# EAGLE design main (EAGLE 9.5.1)
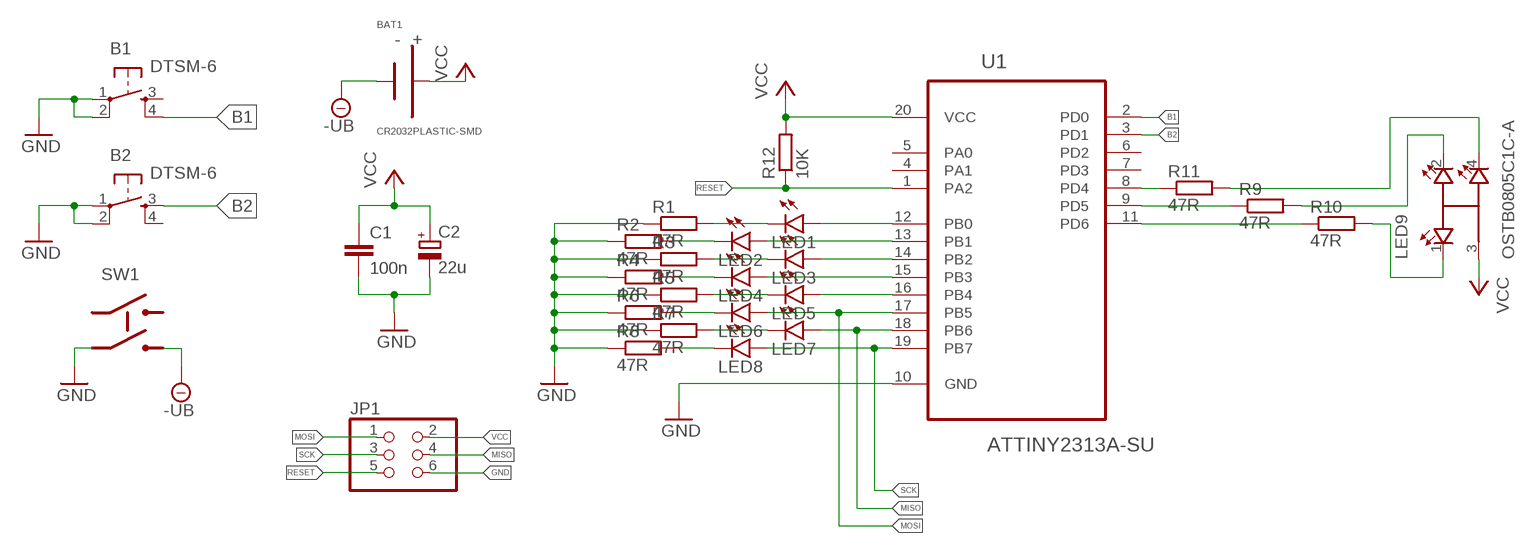
[diagram p0: schematic, sheet 1]

## Parts
B1  DTSM-6  [DTSM-6]
B2  DTSM-6  [DTSM-6]
BAT1  CR2032PLASTIC-SMD  [BIG-SMD]
C1  100n  C-EUC0805  [C0805]
C2  22u  CPOL-EUSMCA  [SMC_A]
JP1  PINHD-2X3  [2X03]
LED1  LEDCHIP-LED0805  [CHIP-LED0805]
LED2  LEDCHIP-LED0805  [CHIP-LED0805]
LED3  LEDCHIP-LED0805  [CHIP-LED0805]
LED4  LEDCHIP-LED0805  [CHIP-LED0805]
LED5  LEDCHIP-LED0805  [CHIP-LED0805]
LED6  LEDCHIP-LED0805  [CHIP-LED0805]
LED7  LEDCHIP-LED0805  [CHIP-LED0805]
LED8  LEDCHIP-LED0805  [CHIP-LED0805]
LED9  OSTB0805C1C-A  [LEDSC200X125X110-4N]
R1  47R  R-EU_R0805  [R0805]
R2  47R  R-EU_R0805  [R0805]
R3  47R  R-EU_R0805  [R0805]
R4  47R  R-EU_R0805  [R0805]
R5  47R  R-EU_R0805  [R0805]
R6  47R  R-EU_R0805  [R0805]
R7  47R  R-EU_R0805  [R0805]
R8  47R  R-EU_R0805  [R0805]
R9  47R  R-EU_R0805  [R0805]
R10  47R  R-EU_R0805  [R0805]
R11  47R  R-EU_R0805  [R0805]
R12  10K  R-EU_R0805  [R0805]
SW1  MSS-22D18  [22D18]
U1  ATTINY2313A-SU  [SOIC127P1032X265-20N]

## Nets
-UB: BAT1.1(MIN) SW1.6(OUT2)
B1: B1.4 U1.2(PD0)
B2: B2.3 U1.3(PD1)
GND: B1.1 B1.2 B2.1 B2.2 C1.2 C2.- JP1.6 R1.1 R2.1 R3.1 R4.1 R5.1 R6.1 R7.1 R8.1 SW1.5(IN2) U1.10(GND)
MISO: JP1.4 LED7.A U1.18(PB6)
MOSI: JP1.1 LED6.A U1.17(PB5)
N$1: LED1.A U1.12(PB0)
N$2: LED1.C R1.2
N$3: LED2.A U1.13(PB1)
N$4: LED2.C R2.2
N$5: LED3.A U1.14(PB2)
N$6: LED3.C R3.2
N$7: LED4.A U1.15(PB3)
N$8: LED4.C R4.2
N$9: LED5.A U1.16(PB4)
N$10: LED5.C R5.2
N$12: LED6.C R6.2
N$14: LED7.C R7.2
N$16: LED8.C R8.2
N$17: R11.1 U1.8(PD4)
N$18: R9.1 U1.9(PD5)
N$19: R10.1 U1.11(PD6)
N$20: LED9.1 R10.2
N$21: LED9.2 R9.2
N$22: LED9.4 R11.2
RESET: JP1.5 R12.1 U1.1(PA2)
SCK: JP1.3 LED8.A U1.19(PB7)
VCC: BAT1.2(PLUS) C1.1 C2.+ JP1.2 LED9.3 R12.2 U1.20(VCC)
Unconnected: B1.3 B2.4 SW1.2(IN1) SW1.3(OUT1) U1.4(PA1) U1.5(PA0) U1.6(PD2) U1.7(PD3)

## Library data of the parts
B1 B2 = switch-tact:DTSM-6
BAT1 = 1Boy-elems:CR2032
C1 = rcl:C-EU: CAPACITOR, European symbol; SPICEPREFIX: C
C2 = resistor:CPOL-EU: POLARIZED CAPACITOR, European symbol
JP1 = pinhead:PINHD-2X3: PIN HEADER
LED1-LED8 = led:LED: LED OSRAM: - CHIPLED LG R971, LG N971, LY N971, LG Q971, LY Q971, LO R971, LY R971 LH N974, LH R974 LS Q976, LO Q976, LY Q976 LO Q996 - Hyper CHIPLED LW Q18S LB Q993, LB Q99A, LB R99A - SideLED LS A670, LO A670, LY A670, LG A670, LP A670 LB A673, LV A673, LT A673, LW A673 LH A674 LY A675 LS A676, LA A676, LO A676, LY A676, LW A676 LS A679, LY A679, LG A679 - Hyper Micro SIDELED® LS Y876, LA Y876, LO Y876, LY Y876 LT Y87S - SmartLED LW L88C, LW L88S LB L89C, LB L89S, LG L890 LS L89K, LO L89K, LY L89K LS L896, LA L896, LO L896, LY L896 - TOPLED LS T670, LO T670, LY T670, LG T670, LP T670 LSG T670, LSP T670, LSY T670, LOP T670, LYG T670 LG T671, LOG T671, LSG T671 LB T673, LV T673, LT T673, LW T673 LH T674 LS T676, LA T676, LO T676, LY T676, LB T676, LH T676, LSB T676, LW T676 LB T67C, LV T67C, LT T67C, LS T67K, LO T67K, LY T67K, LW E67C LS E67B, LA E67B, LO E67B, LY E67B, LB E67C, LV E67C, LT E67C LW T67C LS T679, LY T679, LG T679 LS T770, LO T770, LY T770, LG T770, LP T770 LB T773, LV T773, LT T773, LW T773 LH T774 LS E675, LA E675, LY E675, LS T675 LS T776, LA T776, LO T776, LY T776, LB T776 LHGB T686 LT T68C, LB T68C - Hyper Mini TOPLED® LB M676 - Mini TOPLED Santana® LG M470 LS M47K, LO M47K, LY M47K Source: http://www.osram.convergy.de LUXEON: - LUMILED® LXK2-PW12-R00, LXK2-PW12-S00, LXK2-PW14-U00, LXK2-PW14-V00 LXK2-PM12-R00, LXK2-PM12-S00, LXK2-PM14-U00 LXK2-PE12-Q00, LXK2-PE12-R00, LXK2-PE12-S00, LXK2-PE14-T00, LXK2-PE14-U00 LXK2-PB12-K00, LXK2-PB12-L00, LXK2-PB12-M00, LXK2-PB14-N00, LXK2-PB14-P00, LXK2-PB14-Q00 LXK2-PR12-L00, LXK2-PR12-M00, LXK2-PR14-Q00, LXK2-PR14-R00 LXK2-PD12-Q00, LXK2-PD12-R00, LXK2-PD12-S00 LXK2-PH12-R00, LXK2-PH12-S00 LXK2-PL12-P00, LXK2-PL12-Q00, LXK2-PL12-R00 Source: www.luxeon.com KINGBRIGHT: KA-3528ASYC Source: www.kingbright.com
LED9 = OSTB0805C1C-A:OSTB0805C1C-A: LED; SMD; 0805; RGB; 2x1.25x1.1mm; 120°; 20mA; Variant: tricolour; AVAILABILITY: Unavailable; DESCRIPTION: LED; SMD; 0805; RGB; 2x1.25x1.1mm; 120°; 20mA; Variant: tricolour; MF: OptoSupply; MP: OSTB0805C1C-A; PACKAGE: 0805 OptoSupply; PRICE: None
R1-R12 = rcl:R-EU_: RESISTOR, European symbol; SPICEPREFIX: R
SW1 = 1Boy-elems:MSS-22D18
U1 = ATTINY2313A-SU:ATTINY2313A-SU: 8-bit Microcontroller with In-System Programmable Flash; AVAILABILITY: Unavailable; DESCRIPTION: Embedded microcontroller ATTINY2313A-SU SOIC 20 Microchip Technology 8-Bit 20 MHz I/O number 18; MF: Microchip; MP: ATTINY2313A-SU; PACKAGE: SOIC-20 Microchip; PRICE: None

## Board
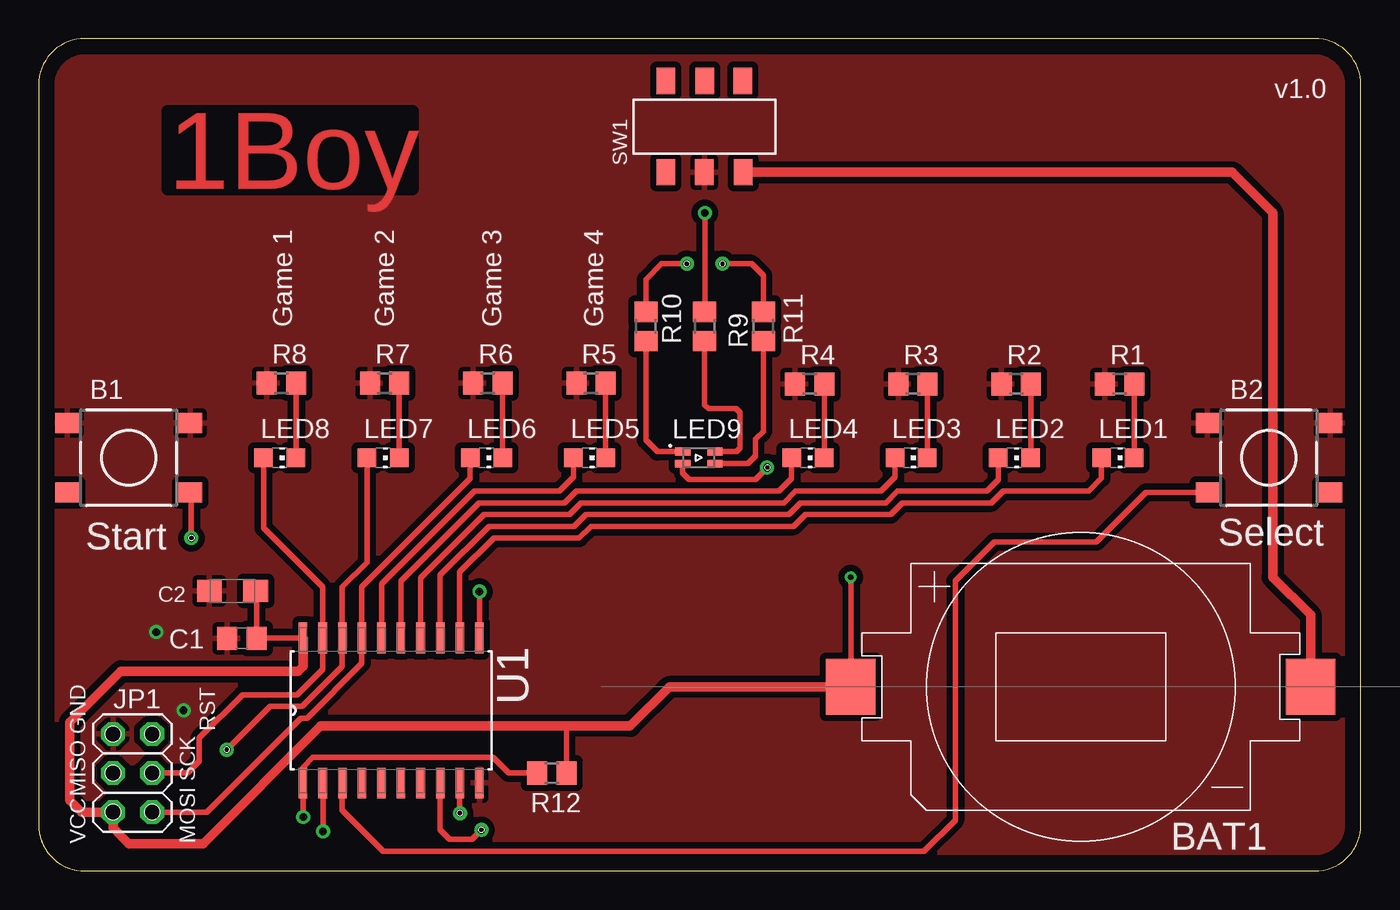
[diagram p1: board, top side]
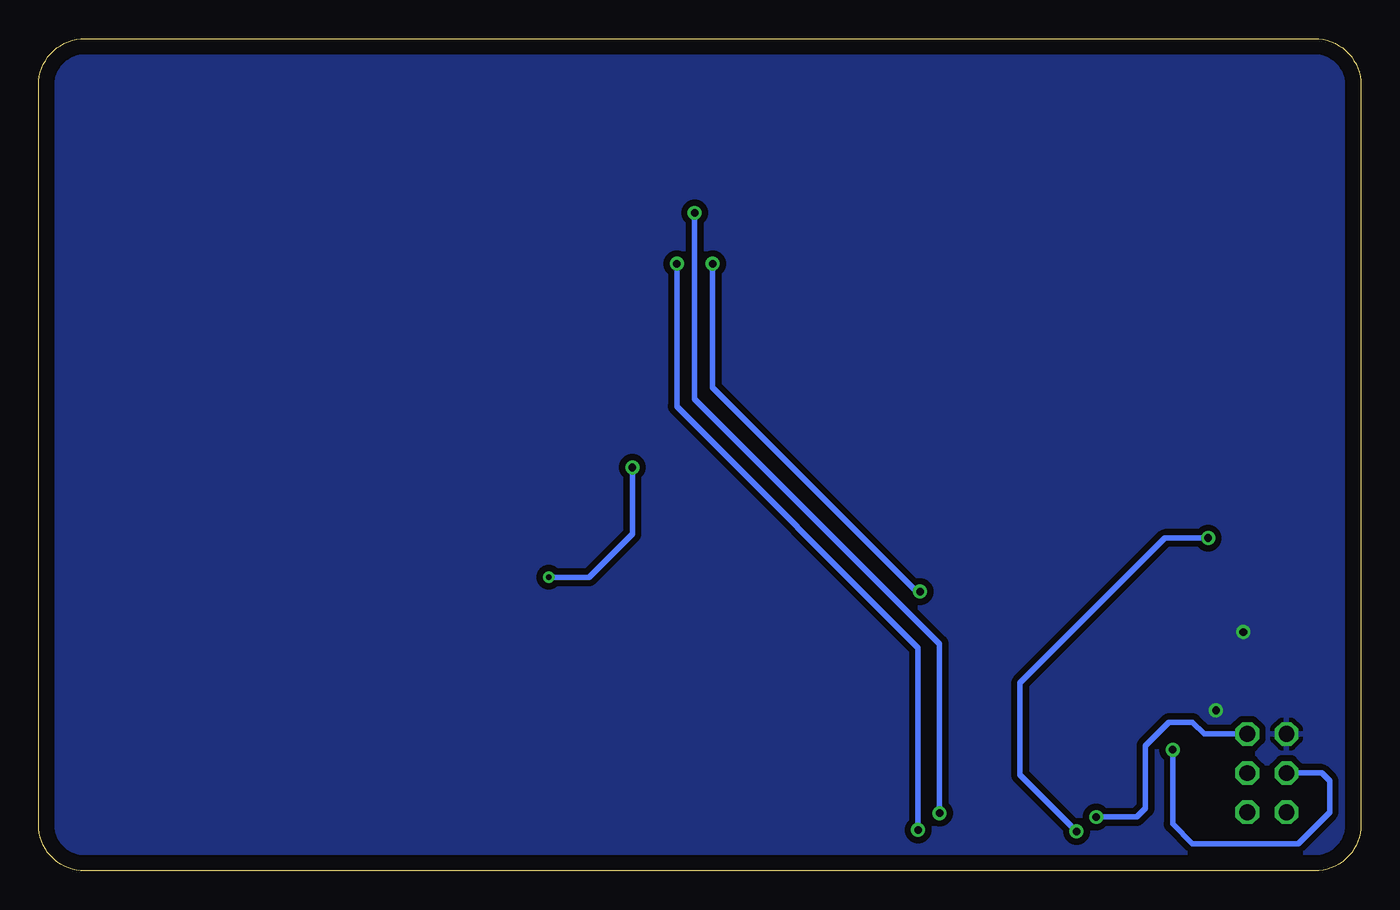
[diagram p2: board, bottom side, seen from below]

Size 85.72 x 53.98 mm. Coordinates in mm from the lower left corner, seen from the top.
Outline: 0,50.98 0,3 arc90 3,0 82.72,0 arc90 85.72,3 85.72,50.98 arc90 82.72,53.98 3,53.98 arc90 0,50.98
Copper layers (1*16): Top 0.035mm / dielectric 1.5mm / Bottom 0.035mm
Design rules "main *": minimum track width 14mil, minimum drill 0.35mm, track to track 16mil, track to pad 16mil, pad to pad 0.205mm, via to via 16mil, smd to smd 6mil, copper to edge 40mil, drill to drill 6mil, minimum pad ring 10mil, minimum via ring 8mil, stop-mask expansion 4mil, vias tented up to drill 1mm, thermal gap 12mil

### Footprints (pad centres in the part's own frame; a part is rotated, then mirrored left to right if it is on the bottom)
DTSM-6 = smd 1.55 x 1.3: 1 -3.975,2.25; 2 3.975,2.25; 3 -3.975,-2.25; 4 3.975,-2.25
BIG-SMD = smd 3.2 x 3.6: 1 -14.904,0; 2 14.904,0
C0805 = smd 1.3 x 1.5: 1 -0.95,0; 2 0.95,0
SMC_A = smd 1.6 x 1.4: + -1.5,0; - 1.5,0
2X03 = drill 1.016 octagon: 1 -2.54,-1.27; 2 -2.54,1.27; 3 0,-1.27; 4 0,1.27; 5 2.54,-1.27; 6 2.54,1.27
CHIP-LED0805 = smd 1.2 x 1.2: A 0,-1.05; C 0,1.05
LEDSC200X125X110-4N = smd 1 x 0.5: 1 -1.05,0.4; 2 1.05,0.4; 3 -1.05,-0.4; 4 1.05,-0.4
R0805 = smd 1.3 x 1.5: 1 -0.95,0; 2 0.95,0
22D18 = smd 1.2 x 1.7: 1 -2.507,2.967; 2 0,2.967; 3 2.472,2.967; 4 -2.524,-2.951; 5 -0.018,-2.952; 6 2.506,-2.952
SOIC127P1032X265-20N = smd 1.981 x 0.559: 1 -4.699,5.715; 2 -4.699,4.445; 3 -4.699,3.175; 4 -4.699,1.905; 5 -4.699,0.635; 6 -4.699,-0.635; 7 -4.699,-1.905; 8 -4.699,-3.175; 9 -4.699,-4.445; 10 -4.699,-5.715; 11 4.699,-5.715; 12 4.699,-4.445; 13 4.699,-3.175; 14 4.699,-1.905; 15 4.699,-0.635; 16 4.699,0.635; 17 4.699,1.905; 18 4.699,3.175; 19 4.699,4.445; 20 4.699,5.715

### Placement (x,y rotation side)
B1  5.84,26.8 0 top
B2  79.76,26.8 0 top
BAT1  67.56,11.94 180 top
C1  13.18,15.09 180 top
C2  12.57,18.16 180 top
JP1  6.1,6.35 90 top
LED1  69.96,26.8 270 top
LED2  63.26,26.8 270 top
LED3  56.57,26.8 270 top
LED4  49.87,26.8 270 top
LED5  35.73,26.8 270 top
LED6  29.03,26.8 270 top
LED7  22.33,26.8 270 top
LED8  15.64,26.8 270 top
LED9  42.8,26.8 0 top
R1  70.08,31.58 0 top
R2  63.38,31.58 0 top
R3  56.68,31.58 0 top
R4  49.99,31.58 0 top
R5  35.81,31.64 0 top
R6  29.13,31.64 0 top
R7  22.44,31.64 0 top
R8  15.75,31.64 0 top
R9  43.18,35.31 270 top
R10  39.37,35.31 270 top
R11  46.99,35.31 270 top
R12  33.27,6.35 0 top
SW1  43.18,48.26 0 top
U1  22.86,10.41 90 top

### Tracks (layer width: path | path; a pad name or v marks a point on that pad's centre or on a via)
-UB
  Top 0.61: SW1.6 77.37,45.31 80.01,42.67 80.01,19.05 82.47,16.59 BAT1.1
B1  (via drill 0.5)
  Top 0.356: B1.4 9.91,24.46 v9.91,21.59 | v18.44,2.56 18.44,5.69 U1.2
  Bottom 0.356: v9.91,21.59 12.7,21.59 22.1,12.19 22.1,6.22 v18.44,2.56
B2
  Top 0.356: U1.3 19.68,3.94 22.35,1.27 47.5,1.27 47.75,1.27 57.4,1.27 59.44,3.3 59.44,18.8 61.98,21.34 68.58,21.34 71.79,24.55 B2.3
GND  (via drill 0.5)
  other vias: 7.62,15.49 9.4,10.41
  pour Top: -2.79,56.13 -2.79,-4.32 90.42,-4.32 90.42,56.13
  pour Bottom: -3.81,57.4 91.19,57.4 91.19,-6.6 -4.06,-6.6 -4.06,55.12
MISO  (via drill 0.5)
  Top 0.356: U1.18 19.68,18.41 21.29,20.02 LED7.A | 19.71,15.09 U1.18 | U1.18 19.68,13.27 17.08,10.67 15,10.67 v12.2,7.87
  Bottom 0.356: JP1.4 2.54,6.35 2.03,5.84 2.03,3.81 4.06,1.78 10.92,1.78 12.2,3.06 v12.2,7.87
MOSI
  Top 0.356: LED6.A 27.98,25.44 20.95,18.41 U1.17 20.95,13.47 17.39,9.91 17,9.91 10.91,3.81 JP1.1
N$1
  Top 0.356: U1.12 27.3,19.38 29.52,21.59 35.05,21.59 35.81,22.35 48.95,22.35 49.72,23.11 55.24,23.11 56,23.88 61.78,23.88 62.55,24.64 68.07,24.64 68.91,25.48 LED1.A
N$2
  Top 0.356: R1.2 71.03,26.82 LED1.C
N$3
  Top 0.356: U1.13 26.04,19.18 29.2,22.35 34.73,22.35 35.49,23.11 48.64,23.11 49.4,23.88 54.93,23.88 55.69,24.64 61.47,24.64 62.23,25.4 62.23,26.78 LED2.A
N$4
  Top 0.356: R2.2 64.33,26.82 LED2.C
N$5
  Top 0.356: U1.14 24.77,18.99 28.89,23.11 34.41,23.11 35.17,23.88 48.32,23.88 49.08,24.64 54.61,24.64 55.52,25.55 LED3.A
N$6
  Top 0.356: R3.2 57.63,26.82 LED3.C
N$7
  Top 0.356: U1.15 23.5,18.8 28.57,23.88 34.1,23.88 34.86,24.64 48.01,24.64 48.82,25.45 LED4.A
N$8
  Top 0.356: R4.2 50.94,26.81 LED4.C
N$9
  Top 0.356: U1.16 22.23,18.61 28.26,24.64 33.78,24.64 34.68,25.53 LED5.A
N$10
  Top 0.356: R5.2 36.76,26.81 LED5.C
N$12
  Top 0.356: R6.2 LED6.C
N$14
  Top 0.356: R7.2 LED7.C
N$16
  Top 0.356: R8.2 LED8.C
N$17  (via drill 0.5)
  Top 0.356: R11.1 46.99,38.61 46.22,39.37 v44.34,39.37 | v28.7,2.67 28.11,2.07 26.63,2.07 26.04,2.67 U1.8
  Bottom 0.356: v44.34,39.37 44.34,30.12 28.7,14.48 v28.7,2.67 28.7,3.23
N$18  (via drill 0.5, 0.5 pad 0.7)
  Top 0.356: R9.1 43.19,36.27 v43.19,42.67 | v27.31,3.75 27.3,3.76 U1.9
  Bottom 0.356: v27.31,3.75 27.31,14.73 43.19,30.61 v43.19,42.67
N$19  (via drill 0.5)
  Top 0.356: R10.1 39.37,38.35 40.38,39.37 v42.02,39.37 | v28.57,18.12 U1.11
  Top 0.406: v28.58,18.12 v28.57,18.12
  Bottom 0.356: v42.02,39.37 42.02,31.34 28.8,18.12 v28.58,18.12
N$20
  Top 0.356: LED9.1 40.11,27.2 39.37,27.94 R10.2
N$21
  Top 0.356: R9.2 43.18,30.23 43.43,29.97 45.21,29.97 45.47,29.72 45.47,27.43 45.23,27.2 LED9.2
N$22
  Top 0.356: LED9.4 43.87,26.42 45.97,26.42 46.48,26.92 46.48,28 46.99,28.51 R11.2
RESET  (via drill 0.5)
  Top 0.356: R12.1 30.48,6.35 29.46,7.37 17.78,7.37 17.14,6.73 U1.1 17.14,3.52 v17.16,3.5
  Bottom 0.356: v17.16,3.5 14.54,3.5 13.97,4.06 13.97,8.13 12.45,9.65 10.92,9.65 10.16,8.89 JP1.5
SCK
  Top 0.356: LED8.A 14.59,22.24 18.41,18.41 U1.19 | 18.39,15.09 U1.19 | U1.19 18.41,13.08 16.76,11.43 13.22,11.43 10.42,8.63 10.42,7.11 9.66,6.35 JP1.3
VCC  (via drill 0.35, 0.5)
  Top 0.356: LED9.3 41.75,25.82 42.16,25.4 46.48,25.4 47.24,26.16 v47.23,26.16 | U1.20 14.16,15.11 C1.1 | C1.1 14.13,18.1 C2.+ | 14.16,15.06 C1.1 | R12.2 34.22,9.33 34.29,9.4 | v52.65,19.05 BAT1.2
  Top 0.61: U1.20 17.14,13.26 16.84,12.95 5.33,12.95 2.03,9.65 2.03,4.57 2.79,3.81 JP1.2 4.83,2.79 5.84,1.78 10.67,1.78 18.29,9.4 34.29,9.4 38.35,9.4 40.89,11.94 BAT1.2
  Bottom 0.356: v47.23,26.16 47.23,21.85 50.04,19.05 v52.65,19.05

### Text on the board
Top: 1Boy
tPlace: v1.0 | Game 1 | Game 2 | Game 3 | Game 4
tNames: Start | Select | GND | RST | SCK | MISO | VCC | MOSI